# EasyEDA schematic SCH_Pathfinder-V1_2025-10-27.json
TITLE: Sheet_1; REV: 1.0; Date: 2025-10-22; Sheet: 1/1; Drawn By: ryantaw; Company: Your Company
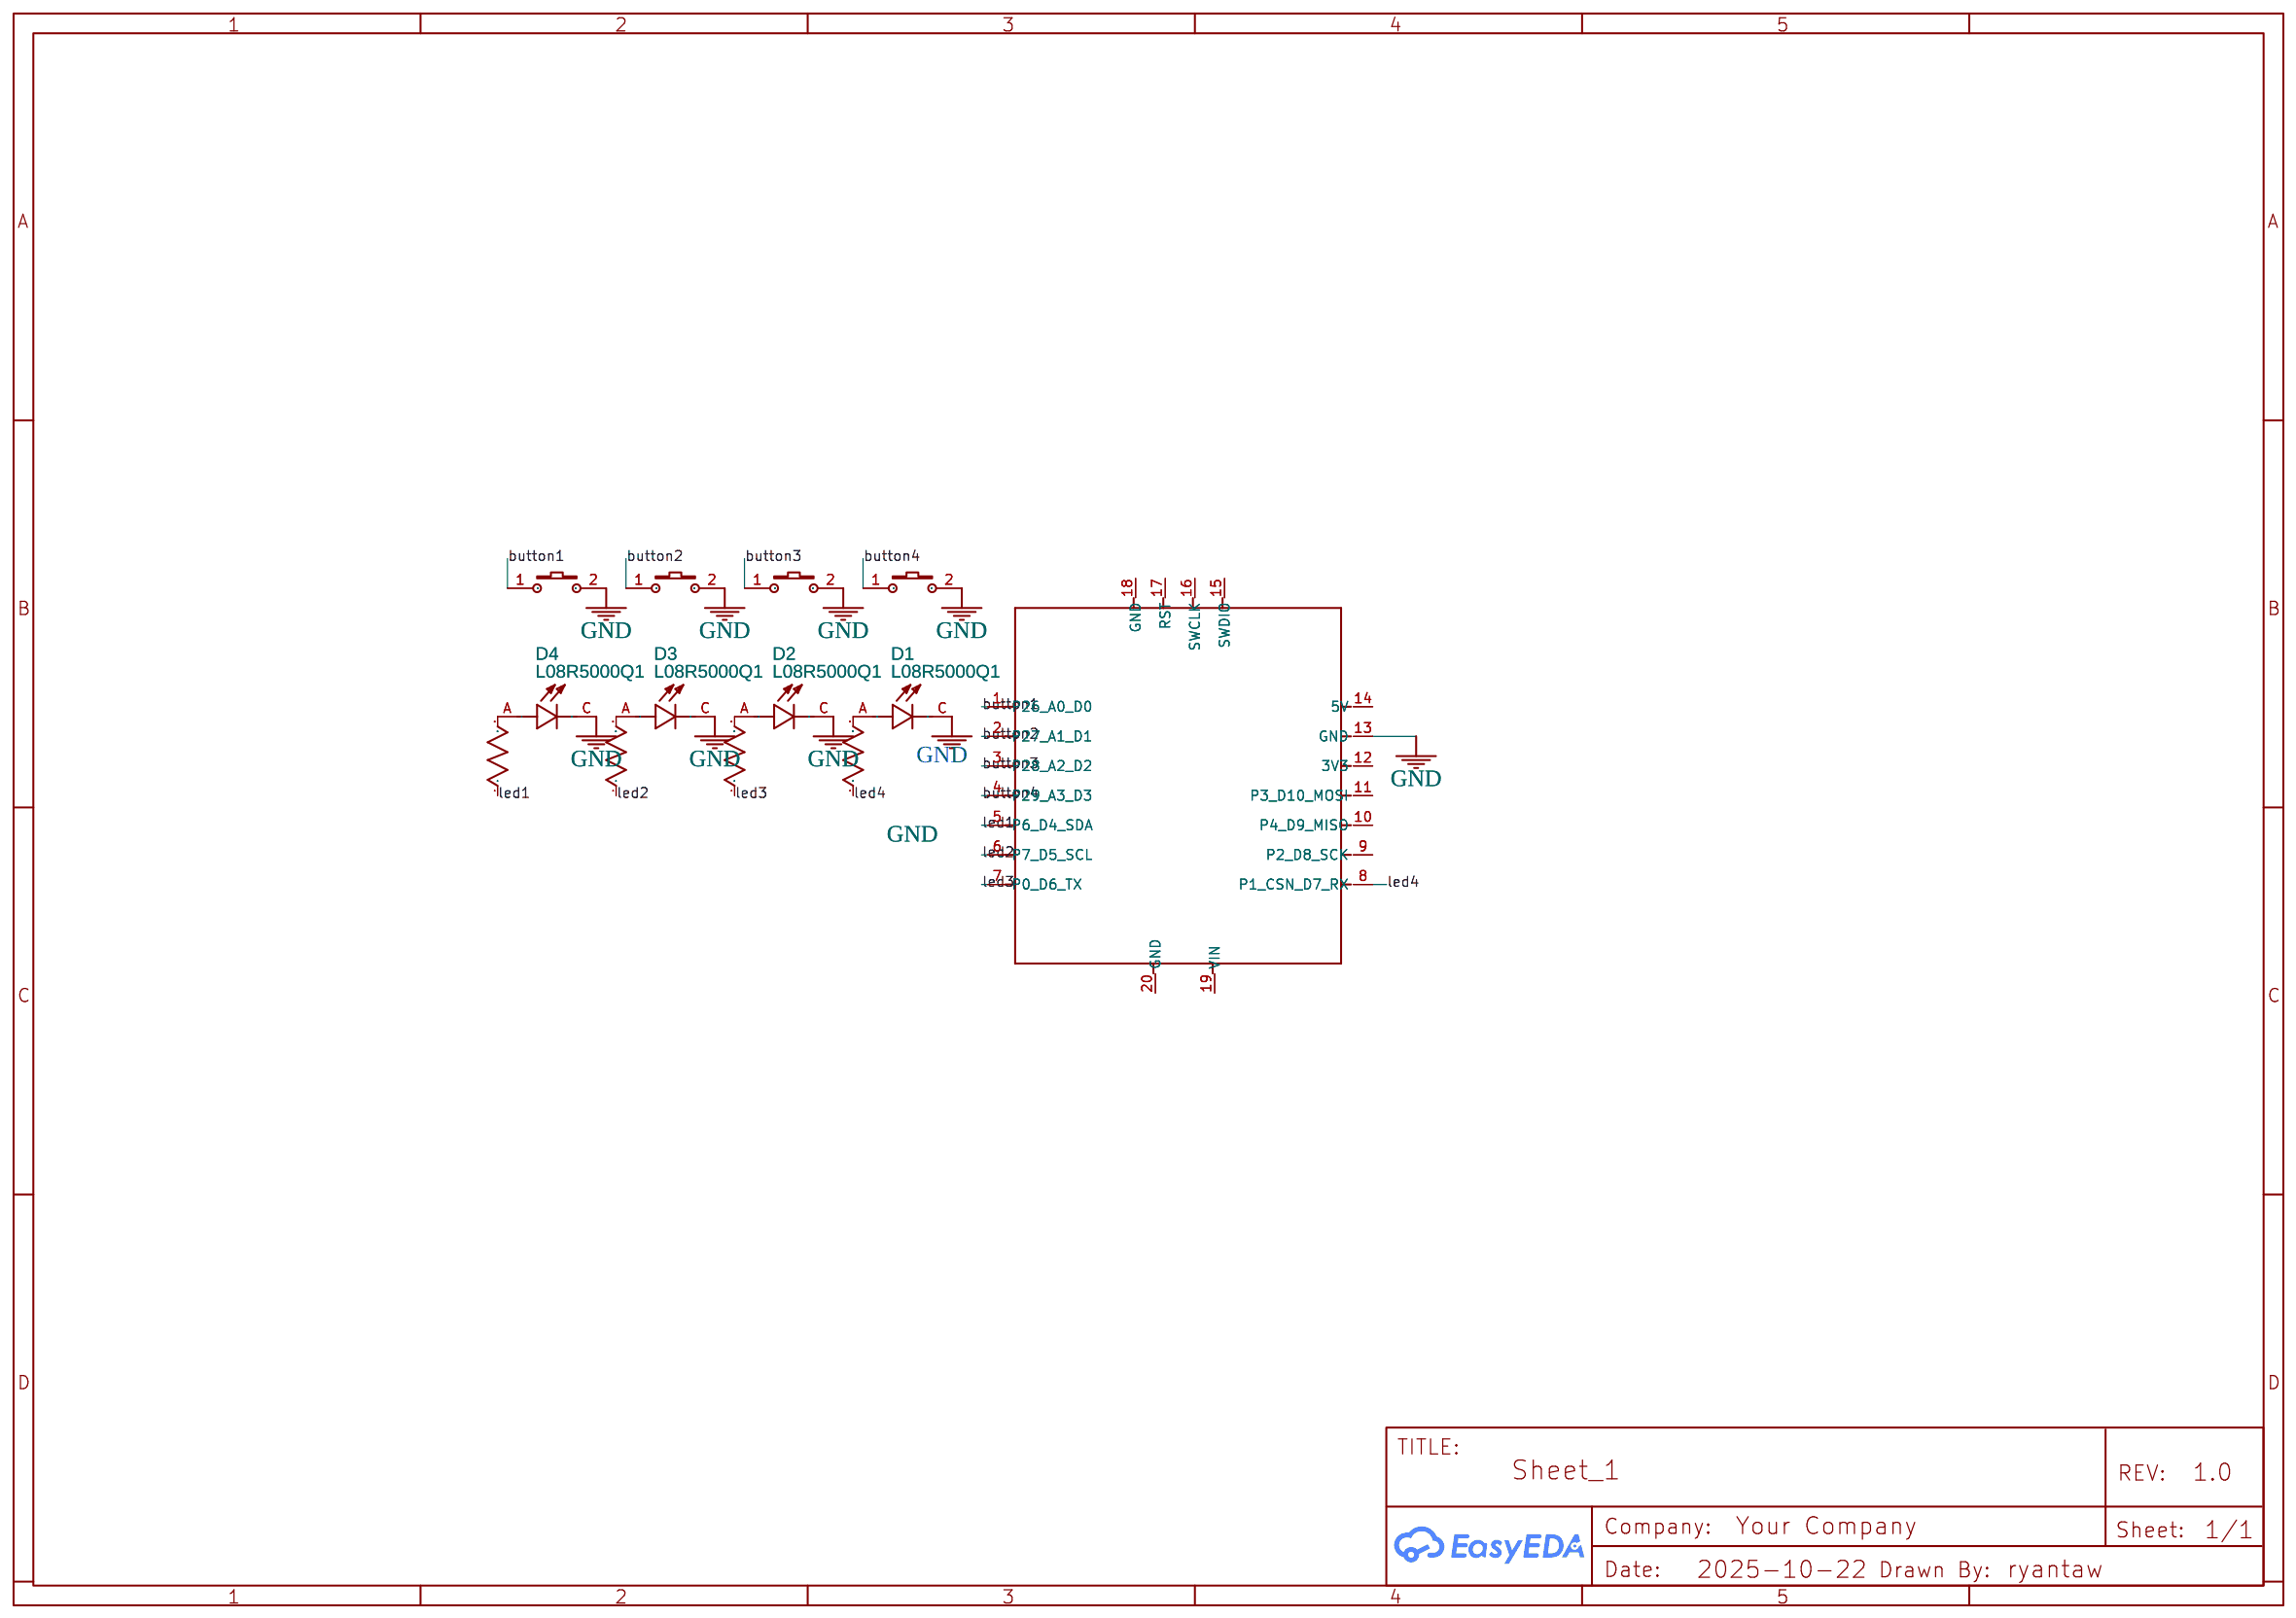
[diagram p0: schematic sheet]

## Parts
D1  L08R5000Q1  [LEDRD254W57D500H1070]
D2  L08R5000Q1  [LEDRD254W57D500H1070]
D3  L08R5000Q1  [LEDRD254W57D500H1070]
D4  L08R5000Q1  [LEDRD254W57D500H1070]
KEY1  K2-3.6×6.1_SMD  [CHERRY MX 1U]
KEY2  K2-3.6×6.1_SMD  [CHERRY MX 1U]
KEY3  K2-3.6×6.1_SMD  [CHERRY MX 1U]
KEY4  K2-3.6×6.1_SMD  [CHERRY MX 1U]
R1  1k  [R_AXIAL_DIN0204_L3.6MM_D1.6MM_P5.08MM_HORIZONTAL]
R2  1k  [R_AXIAL_DIN0204_L3.6MM_D1.6MM_P5.08MM_HORIZONTAL]
R3  1k  [R_AXIAL_DIN0204_L3.6MM_D1.6MM_P5.08MM_HORIZONTAL]
R4  1k  [R_AXIAL_DIN0204_L3.6MM_D1.6MM_P5.08MM_HORIZONTAL]
U1  XIAO-RP2040  [XIAO-SAMD21/RP2040-MODULE14P-2.54-21X17.8MM]

## Library data of the parts
D1-D4 = L08R5000Q1: Contributor: aleca
KEY1-KEY4 = K2-3.6×6.1_SMD: Supplier Part: C118141; Supplier: LCSC; Manufacturer Part: K2-1107ST-A4SW-06; Contributor: LCEDA_Lib; 制造商: 韩国韩荣
R1-R4 = R_0603_US: Contributor: LCEDA_Lib
U1 = XIAO-RP2040: Contributor: jacobstamand

## Nets
GND: D1.C D2.C D3.C D4.C KEY1.2 KEY2.2 KEY3.2 KEY4.2 U1.13(GND)
button1: KEY1.1 U1.1(P26_A0_D0)
button2: KEY2.1 U1.2(P27_A1_D1)
button3: KEY3.1 U1.3(P28_A2_D2)
button4: KEY4.1 U1.4(P29_A3_D3)
led1: R1.1 U1.5(P6_D4_SDA)
led2: R2.1 U1.6(P7_D5_SCL)
led3: R3.1 U1.7(P0_D6_TX)
led4: R4.1 U1.8(P1_CSN_D7_RX)
Net-(D1-A): D1.A R4.2
Net-(D2-A): D2.A R3.2
Net-(D3-A): D3.A R2.2
Net-(D4-A): D4.A R1.2

Not connected (* = marked no-connect by the designer): U1 9(P2_D8_SCK) 10(P4_D9_MISO) 11(P3_D10_MOSI) 12(3V3) 14(5V) 15(SWDIO) 16(SWCLK) 17(RST) 18(GND) 19(VIN) 20(GND)

## Notes on the sheet
- GND
